# Altium schematic sheet Motor1.SchDoc
size A; SheetNumber: 1; SheetTotal: 4
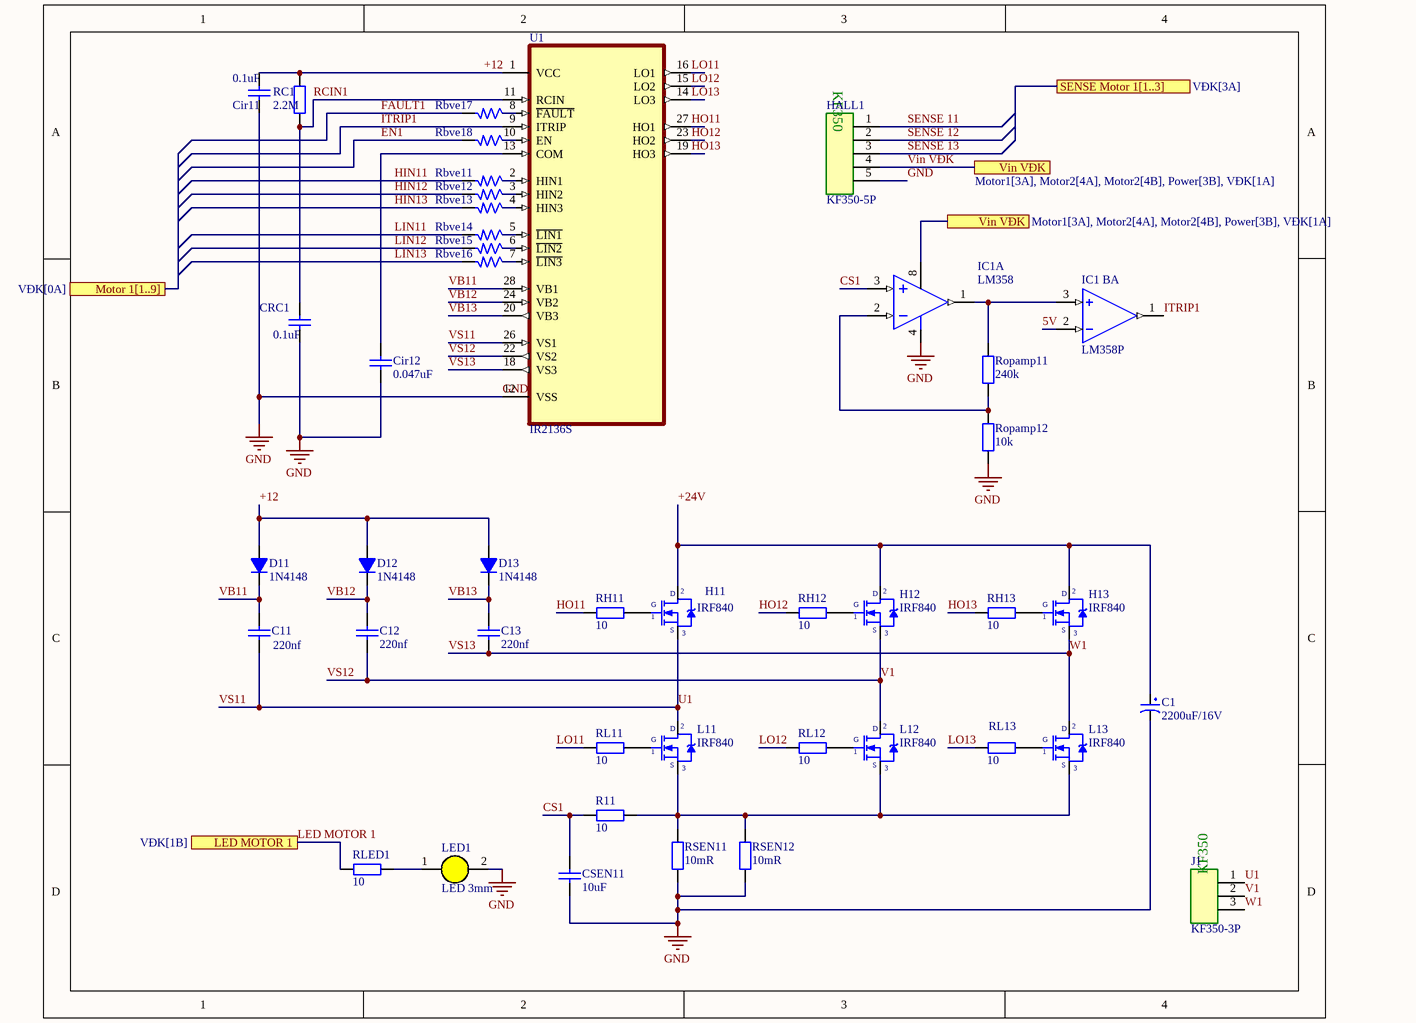
[diagram p0: Motor1.SchDoc]

## Parts
C1  2200uF/16V  [CP2/4]
C11  value 220nf  [Tu-pico]  (hidden comment: Capacitor Ceramic)
C12  value 220nf  [Tu-pico]  (hidden comment: Capacitor Ceramic)
C13  value 220nf  [Tu-pico]  (hidden comment: Capacitor Ceramic)
Cir11  value 0.1uF  [Tu-pico]  (hidden comment: Capacitor Ceramic)
Cir12  value 0.047uF  [Tu-pico]  (hidden comment: Capacitor Ceramic)
CRC1  value 0.1uF  [Tu-pico]  (hidden comment: Capacitor Ceramic)
CSEN11  value 10uF  [Tu-pico]  (hidden comment: Capacitor Ceramic)
D11  1N4148  [D0.5A]
D12  1N4148  [D0.5A]
D13  1N4148  [D0.5A]
H11  IRF840  [QTO-220]
H12  IRF840  [QTO-220]
H13  IRF840  [QTO-220]
HALL1  KF350-5P  [KF350-5P]
IC1  LM358  [DIP8/W0.3]  (part A of 2)
IC1_B  LM358P  [DIP794W45P254L959H508Q8]  (part A of 3)
J1  KF350-3P  [KF350-3P]
L11  IRF840  [QTO-220]
L12  IRF840  [QTO-220]
L13  IRF840  [QTO-220]
LED1  LED 3mm  [LED-3MM-YELLOW]
R11  10  [R1/4W]
Rbve11  1m  [SM-1206]  (value not drawn)
Rbve12  1m  [SM-1206]  (value not drawn)
Rbve13  1m  [SM-1206]  (value not drawn)
Rbve14  1m  [SM-1206]  (value not drawn)
Rbve15  1m  [SM-1206]  (value not drawn)
Rbve16  1m  [SM-1206]  (value not drawn)
Rbve17  1m  [SM-1206]  (value not drawn)
Rbve18  1m  [SM-1206]  (value not drawn)
RC1  2.2M  [R1/4W]
RH11  10  [R1/4W]
RH12  10  [R1/4W]
RH13  10  [R1/4W]
RL11  10  [R1/4W]
RL12  10  [R1/4W]
RL13  10  [R1/4W]
RLED1  10  [R1/4W]
Ropamp11  240k  [R1/4W]
Ropamp12  10k  [R1/4W]
RSEN11  10mR  [Shunt 10mR 1.2x10x7MM]
RSEN12  10mR  [Shunt 10mR 1.2x10x7MM]
U1  IR2136S  [SOIC127PX1032X265-28N]

## Ports
LED MOTOR 1 (see VĐK[1B]), Motor 1[1..9] (see VĐK[0A]), SENSE Motor 1[1..3] (see VĐK[3A]), Vin VĐK (see Motor1[3A], Motor2[4A], Motor2[4B], Power[3B], VĐK[1A])

## Nets
GND: C1.2 Cir11.2 Cir12.2 CRC1.2 CSEN11.2 HALL1.5 IC1.4(-V) LED1.2(K) Ropamp12.2 RSEN11.1 RSEN12.1 U1.12(VSS)
5V: IC1_B.2(-IN1)
+12: Cir11.1 D11.1(A) D12.1(A) D13.1(A) RC1.2 U1.1(VCC)
+24V: C1.1 H11.2(D) H12.2(D) H13.2(D)
CS1: CSEN11.1 IC1.3(IN+) R11.2
EN1: Rbve18.2
FAULT1: Rbve17.2
HIN11: Rbve11.2
HIN12: Rbve12.2
HIN13: Rbve13.2
HO11: RH11.1 U1.27(HO1)
HO12: RH12.1 U1.23(HO2)
HO13: RH13.1 U1.19(HO3)
ITRIP1: IC1_B.1(OUT1) U1.9(ITRIP)
LED MOTOR 1: RLED1.2 ; port LED MOTOR 1
LIN11: Rbve14.2
LIN12: Rbve15.2
LIN13: Rbve16.2
LO11: RL11.1 U1.16(LO1)
LO12: RL12.1 U1.15(LO2)
LO13: RL13.2 U1.14(LO3)
RCIN1: CRC1.1 RC1.1 U1.11(RCIN)
SENSE 11: HALL1.1
SENSE 12: HALL1.2
SENSE 13: HALL1.3
U1: C11.2 H11.3(S) J1.1 L11.2(D) U1.26(VS1)  [also labelled VS11]
V1: C12.2 H12.3(S) J1.2 L12.2(D) U1.22(VS2)  [also labelled VS12]
VB11: C11.1 D11.2(K) U1.28(VB1)
VB12: C12.1 D12.2(K) U1.24(VB2)
VB13: C13.1 D13.2(K) U1.20(VB3)
Vin VĐK: HALL1.4 IC1.8(+V) ; port Vin VĐK
VS13: C13.2 H13.3(S) J1.3 L13.2(D) U1.18(VS3)  [also labelled W1]
NetCir12_1: Cir12.1 U1.13(COM)
NetH11_1: H11.1(G) RH11.2
NetH12_1: H12.1(G) RH12.2
NetH13_1: H13.1(G) RH13.2
NetIC1_1: IC1.1(OUT) IC1_B.3(+IN1) Ropamp11.1
NetIC1_2: IC1.2(IN-) Ropamp11.2 Ropamp12.1
NetL11_1: L11.1(G) RL11.2
NetL11_3: L11.3(S) L12.3(S) L13.3(S) R11.1 RSEN11.2 RSEN12.2
NetL12_1: L12.1(G) RL12.2
NetL13_1: L13.1(G) RL13.1
NetLED1_1: LED1.1(A) RLED1.1
NetRbve11_1: Rbve11.1 U1.2(HIN1)
NetRbve12_1: Rbve12.1 U1.3(HIN2)
NetRbve13_1: Rbve13.1 U1.4(HIN3)
NetRbve14_1: Rbve14.1 U1.5(~{LIN1})
NetRbve15_1: Rbve15.1 U1.6(~{LIN2})
NetRbve16_1: Rbve16.1 U1.7(~{LIN3})
NetRbve17_1: Rbve17.1 U1.8(~{FAULT})
NetRbve18_1: Rbve18.1 U1.10(EN)

## Notes on the sheet
- (in symbol KF350-3P) KF350
- (in symbol KF350-5P) KF350

## Library data of the parts
C1 = CP5: Cap 2200uF/16V - 1000uF/50V; Description 5: 47uF/200V - 22uF/350V - 400V - 10uF/450V; Description 1: 4700uF-6800uF/6,3V - 3300uF-4700uF/10V; Description 2: 2200uF-3300uF/16V - 470uF => 2200uF/25V; Description 3: 1000uF/35V-50V_470uF/63V_220uF>330uF/100V; Description 4: 47uF => 100uF/160V - 33uF-47uF/250V; Value: 2200uF/16V
C11-C13 Cir11 Cir12 CRC1 CSEN11 = CapCeramic: Capacitor; Published: 8-Jun-2000; LatestRevisionDate: 17-Jul-2002; LatestRevisionNote: Re-released for DXP Platform.; PackageReference: RAD-0.3; Publisher: Altium Limited
D11-D13 = D0.5A: Value: 1N4148
H11-H13 L11-L13 = IRF840: MOSFET N - CHANNEL 500V - 0.75 - 8A - TO-220; Value: IRF840
IC1 = LM358: Low-Power Dual Operational Amplifier; Value: LM358
IC1_B = LM358P: Dual, 30-V, 700-kHz operational amplifier; MF: Texas Instruments; SnapEDA_Link: https://www.snapeda.com/parts/LM358P/Texas+Instruments/view-part/?ref=snap; Package: PDIP-8 Texas; Value: *; MP: LM358P; Check_prices: https://www.snapeda.com/parts/LM358P/Texas+Instruments/view-part/?ref=eda
LED1 = LED 3mm Vang: Cắm; Don_Vi: Con; Ma_Hang: MH003893; Ten_Linh_Kien: Led 3MM Phủ Vàng (10c); Ghi_Chu: *; Kieu_Chan: *; Chung_Loai: Cắm
R11 RC1 RH11-RH13 RL11-RL13 RLED1 Ropamp11 Ropamp12 = R1/4W: Resistor 1/4W; Value: R1/4W - 1K
Rbve11-Rbve18 = R: Resistor 1/4W; Value: R1/4W - 1K
RSEN11 RSEN12 = Shunt 10mR 1.2x10x7MM
U1 = IR2136S: IC Ä‘iá»u khiá»ƒn ná»­a cáº§u cá»•ng Ä‘áº£o ngÆ°á»£c 28-SOIC; MF: Infineon; Package: SOIC-28 Infineon; Availability: Unavailable; MP: IR2136S; Value: *; SnapEDA_Link: https://www.snapeda.com/parts/IR2136S/Infineon%20Technologies/view-part/652863/?ref=snap; Price: None